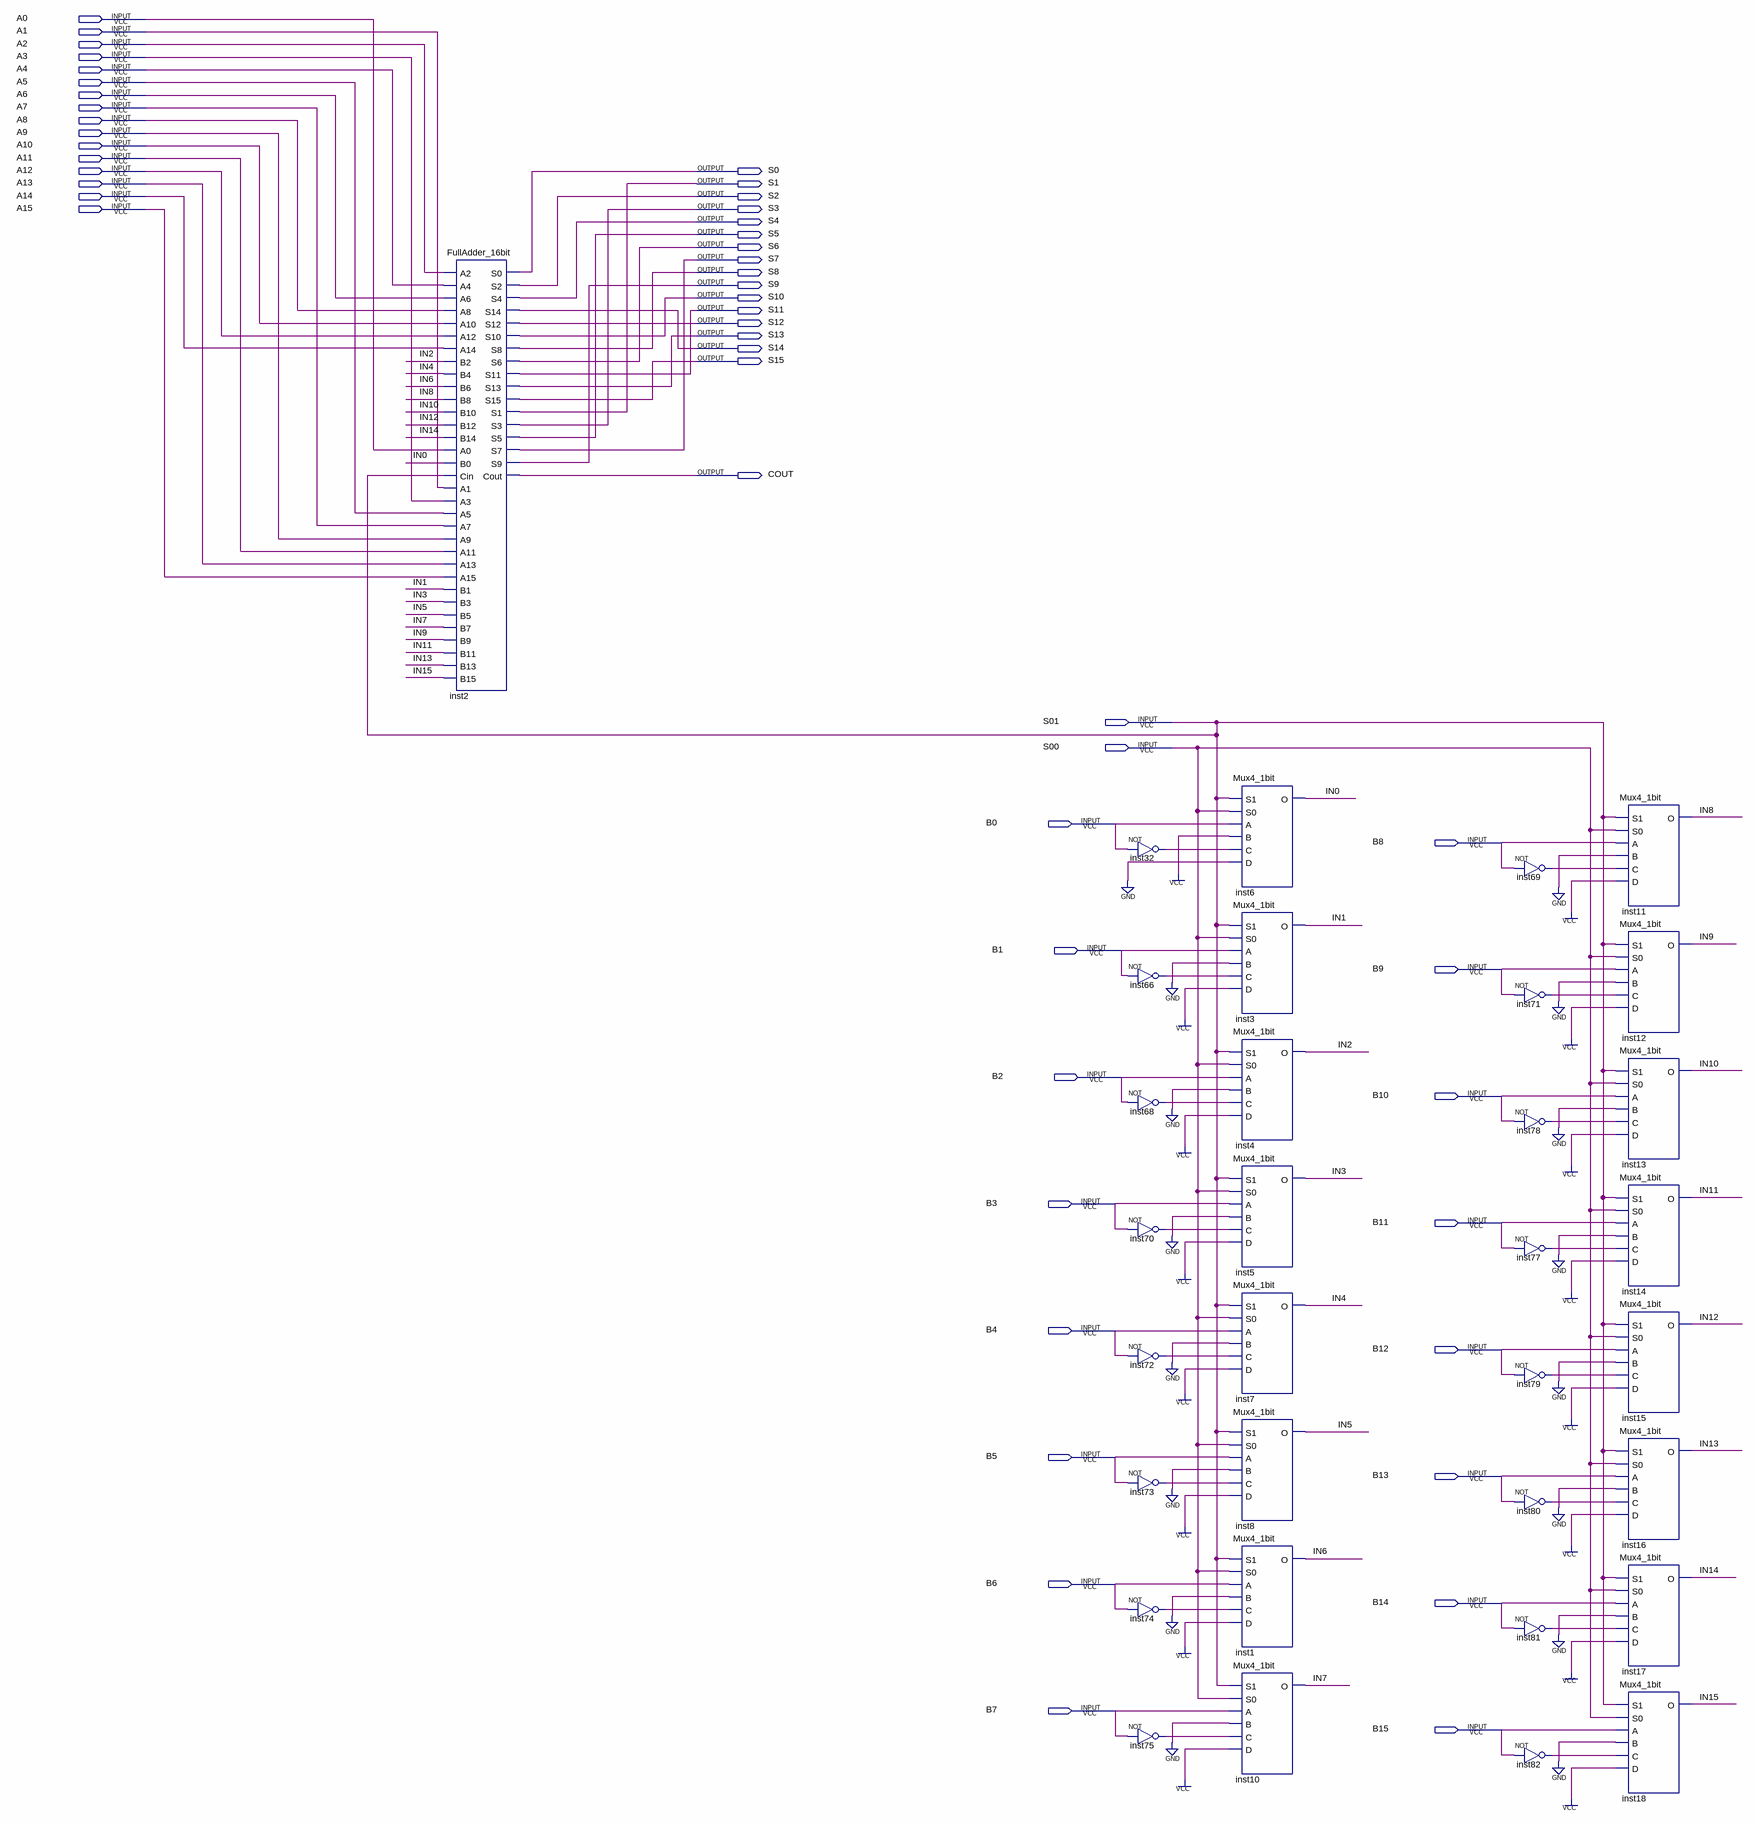
[diagram p0: schematic sheet]
// Quartus schematic FullAdder_16bit_Optimized.bdf as structural Verilog: 33 symbols, 51 pins
module FullAdder_16bit_Optimized (
  input  A0,
  input  A1,
  input  A2,
  input  A3,
  input  A4,
  input  A5,
  input  A6,
  input  A7,
  input  A8,
  input  A9,
  input  A10,
  input  A11,
  input  A12,
  input  A13,
  input  A14,
  input  A15,
  input  S01,
  input  S00,
  input  B0,
  input  B8,
  input  B1,
  input  B9,
  input  B2,
  input  B10,
  input  B3,
  input  B11,
  input  B4,
  input  B12,
  input  B5,
  input  B13,
  input  B6,
  input  B14,
  input  B7,
  input  B15,
  output S0,
  output S1,
  output S2,
  output S3,
  output S4,
  output S5,
  output S6,
  output S7,
  output S8,
  output S9,
  output S10,
  output S11,
  output S12,
  output S13,
  output S14,
  output S15,
  output COUT
);

  wire IN0, IN1, IN2, IN3, IN4, IN5, IN6, IN7, IN8, IN9, IN10, IN11, IN12, IN13, IN14, IN15, inst32_out,
       inst66_out, inst68_out, inst69_out, inst70_out, inst71_out, inst72_out, inst73_out, inst74_out,
       inst75_out, inst77_out, inst78_out, inst79_out, inst80_out, inst81_out, inst82_out;

  FullAdder_16bit inst2 (
    .A2(A2), .A4(A4), .A6(A6), .A8(A8), .A10(A10), .A12(A12), .A14(A14), .B2(IN2), .B4(IN4), .B6(IN6),
    .B8(IN8), .B10(IN10), .B12(IN12), .B14(IN14), .A0(A0), .B0(IN0), .Cin(S01), .A1(A1), .A3(A3), .A5(A5),
    .A7(A7), .A9(A9), .A11(A11), .A13(A13), .A15(A15), .B1(IN1), .B3(IN3), .B5(IN5), .B7(IN7), .B9(IN9),
    .B11(IN11), .B13(IN13), .B15(IN15), .S0(S0), .S2(S2), .S4(S4), .S14(S14), .S12(S12), .S10(S10), .S8(S8),
    .S6(S6), .S11(S11), .S13(S13), .S15(S15), .S1(S1), .S3(S3), .S5(S5), .S7(S7), .S9(S9), .Cout(COUT));
  not inst32 (inst32_out, B0);
  not inst66 (inst66_out, B1);
  not inst68 (inst68_out, B2);
  not inst70 (inst70_out, B3);
  not inst72 (inst72_out, B4);
  not inst73 (inst73_out, B5);
  not inst74 (inst74_out, B6);
  not inst75 (inst75_out, B7);
  Mux4_1bit inst6 (.S1(S01), .S0(S00), .A(B0), .B(1'b1), .C(inst32_out), .D(1'b0), .O(IN0));
  Mux4_1bit inst3 (.S1(S01), .S0(S00), .A(B1), .B(1'b0), .C(inst66_out), .D(1'b1), .O(IN1));
  Mux4_1bit inst4 (.S1(S01), .S0(S00), .A(B2), .B(1'b0), .C(inst68_out), .D(1'b1), .O(IN2));
  Mux4_1bit inst5 (.S1(S01), .S0(S00), .A(B3), .B(1'b0), .C(inst70_out), .D(1'b1), .O(IN3));
  Mux4_1bit inst7 (.S1(S01), .S0(S00), .A(B4), .B(1'b0), .C(inst72_out), .D(1'b1), .O(IN4));
  Mux4_1bit inst8 (.S1(S01), .S0(S00), .A(B5), .B(1'b0), .C(inst73_out), .D(1'b1), .O(IN5));
  Mux4_1bit inst1 (.S1(S01), .S0(S00), .A(B6), .B(1'b0), .C(inst74_out), .D(1'b1), .O(IN6));
  Mux4_1bit inst10 (.S1(S01), .S0(S00), .A(B7), .B(1'b0), .C(inst75_out), .D(1'b1), .O(IN7));
  not inst69 (inst69_out, B8);
  not inst71 (inst71_out, B9);
  not inst78 (inst78_out, B10);
  not inst77 (inst77_out, B11);
  not inst79 (inst79_out, B12);
  not inst80 (inst80_out, B13);
  not inst81 (inst81_out, B14);
  not inst82 (inst82_out, B15);
  Mux4_1bit inst11 (.S1(S01), .S0(S00), .A(B8), .B(1'b0), .C(inst69_out), .D(1'b1), .O(IN8));
  Mux4_1bit inst12 (.S1(S01), .S0(S00), .A(B9), .B(1'b0), .C(inst71_out), .D(1'b1), .O(IN9));
  Mux4_1bit inst13 (.S1(S01), .S0(S00), .A(B10), .B(1'b0), .C(inst78_out), .D(1'b1), .O(IN10));
  Mux4_1bit inst14 (.S1(S01), .S0(S00), .A(B11), .B(1'b0), .C(inst77_out), .D(1'b1), .O(IN11));
  Mux4_1bit inst15 (.S1(S01), .S0(S00), .A(B12), .B(1'b0), .C(inst79_out), .D(1'b1), .O(IN12));
  Mux4_1bit inst16 (.S1(S01), .S0(S00), .A(B13), .B(1'b0), .C(inst80_out), .D(1'b1), .O(IN13));
  Mux4_1bit inst17 (.S1(S01), .S0(S00), .A(B14), .B(1'b0), .C(inst81_out), .D(1'b1), .O(IN14));
  Mux4_1bit inst18 (.S1(S01), .S0(S00), .A(B15), .B(1'b0), .C(inst82_out), .D(1'b1), .O(IN15));
endmodule
